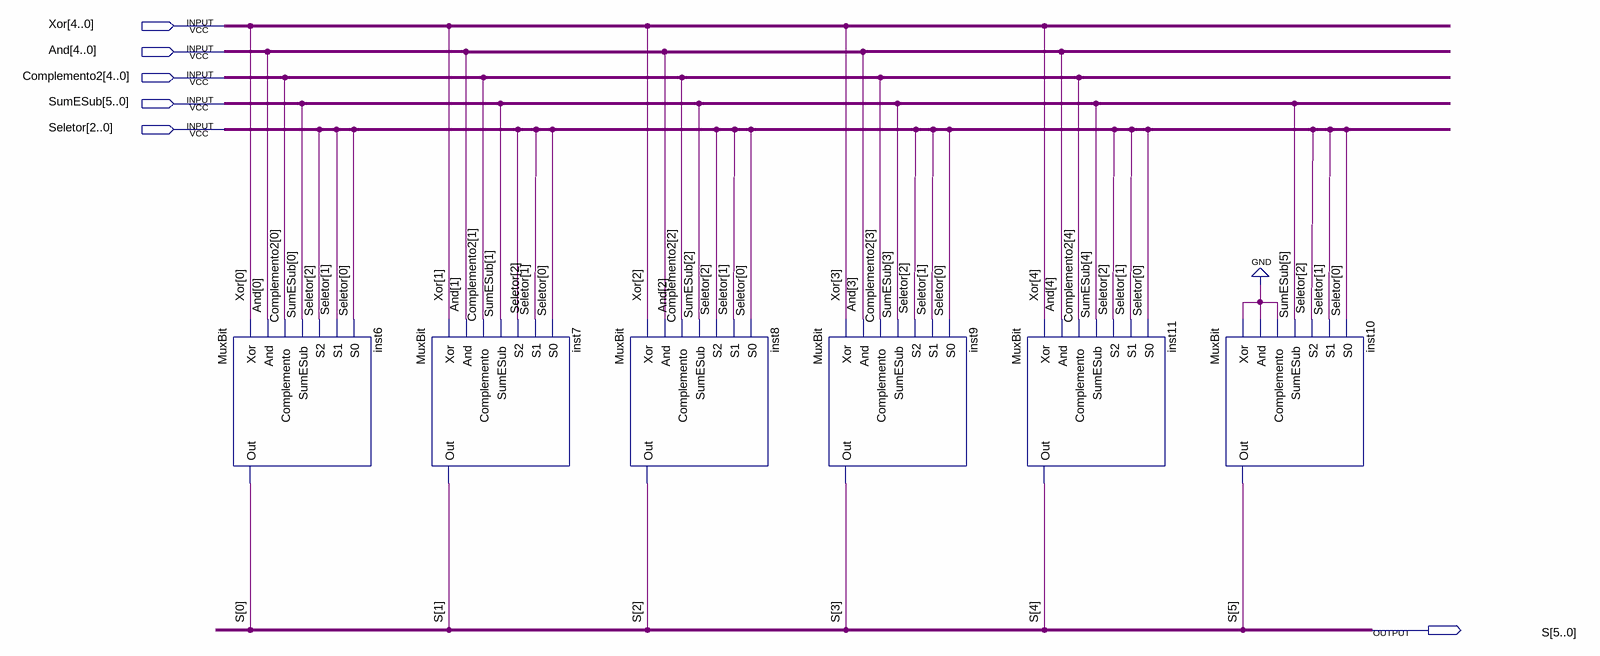
[diagram p0: schematic sheet]
// Quartus schematic Mux6Bits.bdf as structural Verilog: 6 symbols, 6 pins
module Mux6Bits (
  input  [4:0] Xor,
  input  [4:0] And,
  input  [4:0] Complemento2,
  input  [5:0] SumESub,
  input  [2:0] Seletor,
  output [5:0] S
);

  MuxBit inst6 (
    .Xor(Xor[0]), .And(And[0]), .Complemento(Complemento2[0]), .SumESub(SumESub[0]), .S2(Seletor[2]),
    .S1(Seletor[1]), .S0(Seletor[0]), .Out(S[0]));
  MuxBit inst7 (
    .Xor(Xor[1]), .And(And[1]), .Complemento(Complemento2[1]), .SumESub(SumESub[1]), .S2(Seletor[2]),
    .S1(Seletor[1]), .S0(Seletor[0]), .Out(S[1]));
  MuxBit inst8 (
    .Xor(Xor[2]), .And(And[2]), .Complemento(Complemento2[2]), .SumESub(SumESub[2]), .S2(Seletor[2]),
    .S1(Seletor[1]), .S0(Seletor[0]), .Out(S[2]));
  MuxBit inst9 (
    .Xor(Xor[3]), .And(And[3]), .Complemento(Complemento2[3]), .SumESub(SumESub[3]), .S2(Seletor[2]),
    .S1(Seletor[1]), .S0(Seletor[0]), .Out(S[3]));
  MuxBit inst11 (
    .Xor(Xor[4]), .And(And[4]), .Complemento(Complemento2[4]), .SumESub(SumESub[4]), .S2(Seletor[2]),
    .S1(Seletor[1]), .S0(Seletor[0]), .Out(S[4]));
  MuxBit inst10 (
    .Xor(1'b0), .And(1'b0), .Complemento(1'b0), .SumESub(SumESub[5]), .S2(Seletor[2]), .S1(Seletor[1]),
    .S0(Seletor[0]), .Out(S[5]));
endmodule
